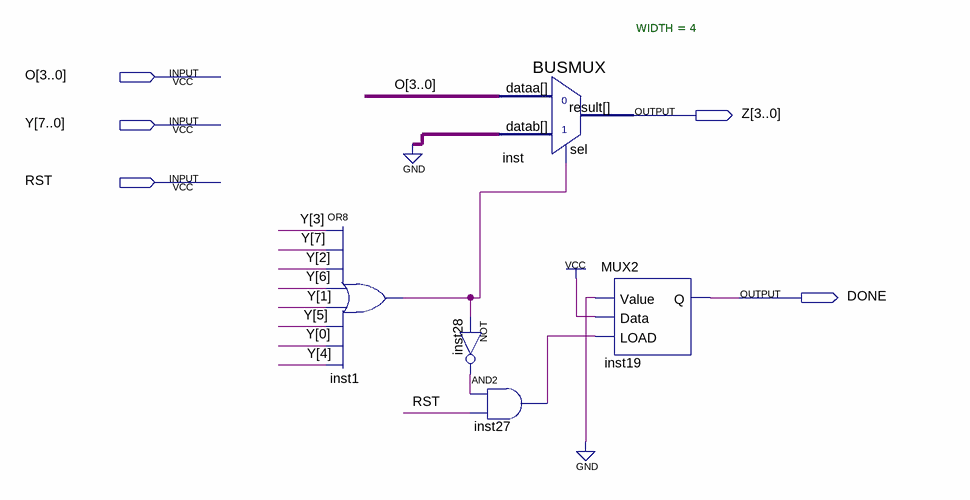
[diagram p0: schematic sheet]
// Quartus schematic OUTPUT.bdf as structural Verilog: 5 symbols, 5 pins
module OUTPUT (
  input  [3:0] O,
  input  [7:0] Y,
  input  RST,
  output [3:0] Z,
  output DONE
);

  wire inst1_out, inst27_out, inst28_out;

  or inst1 (inst1_out, Y[3], Y[7], Y[2], Y[6], Y[1], Y[5], Y[0], Y[4]);
  not inst28 (inst28_out, inst1_out);
  and inst27 (inst27_out, inst28_out, RST);
  BUSMUX #(.WIDTH(4)) inst (.datab(4'b0000), .sel(inst1_out), .dataa(O), .result(Z));
  MUX2 inst19 (.Value(1'b0), .Data(1'b1), .LOAD(inst27_out), .Q(DONE));
endmodule
